# EAGLE design main (EAGLE 9.2.2)

## Sheet 1 of 4: TIVA + IC
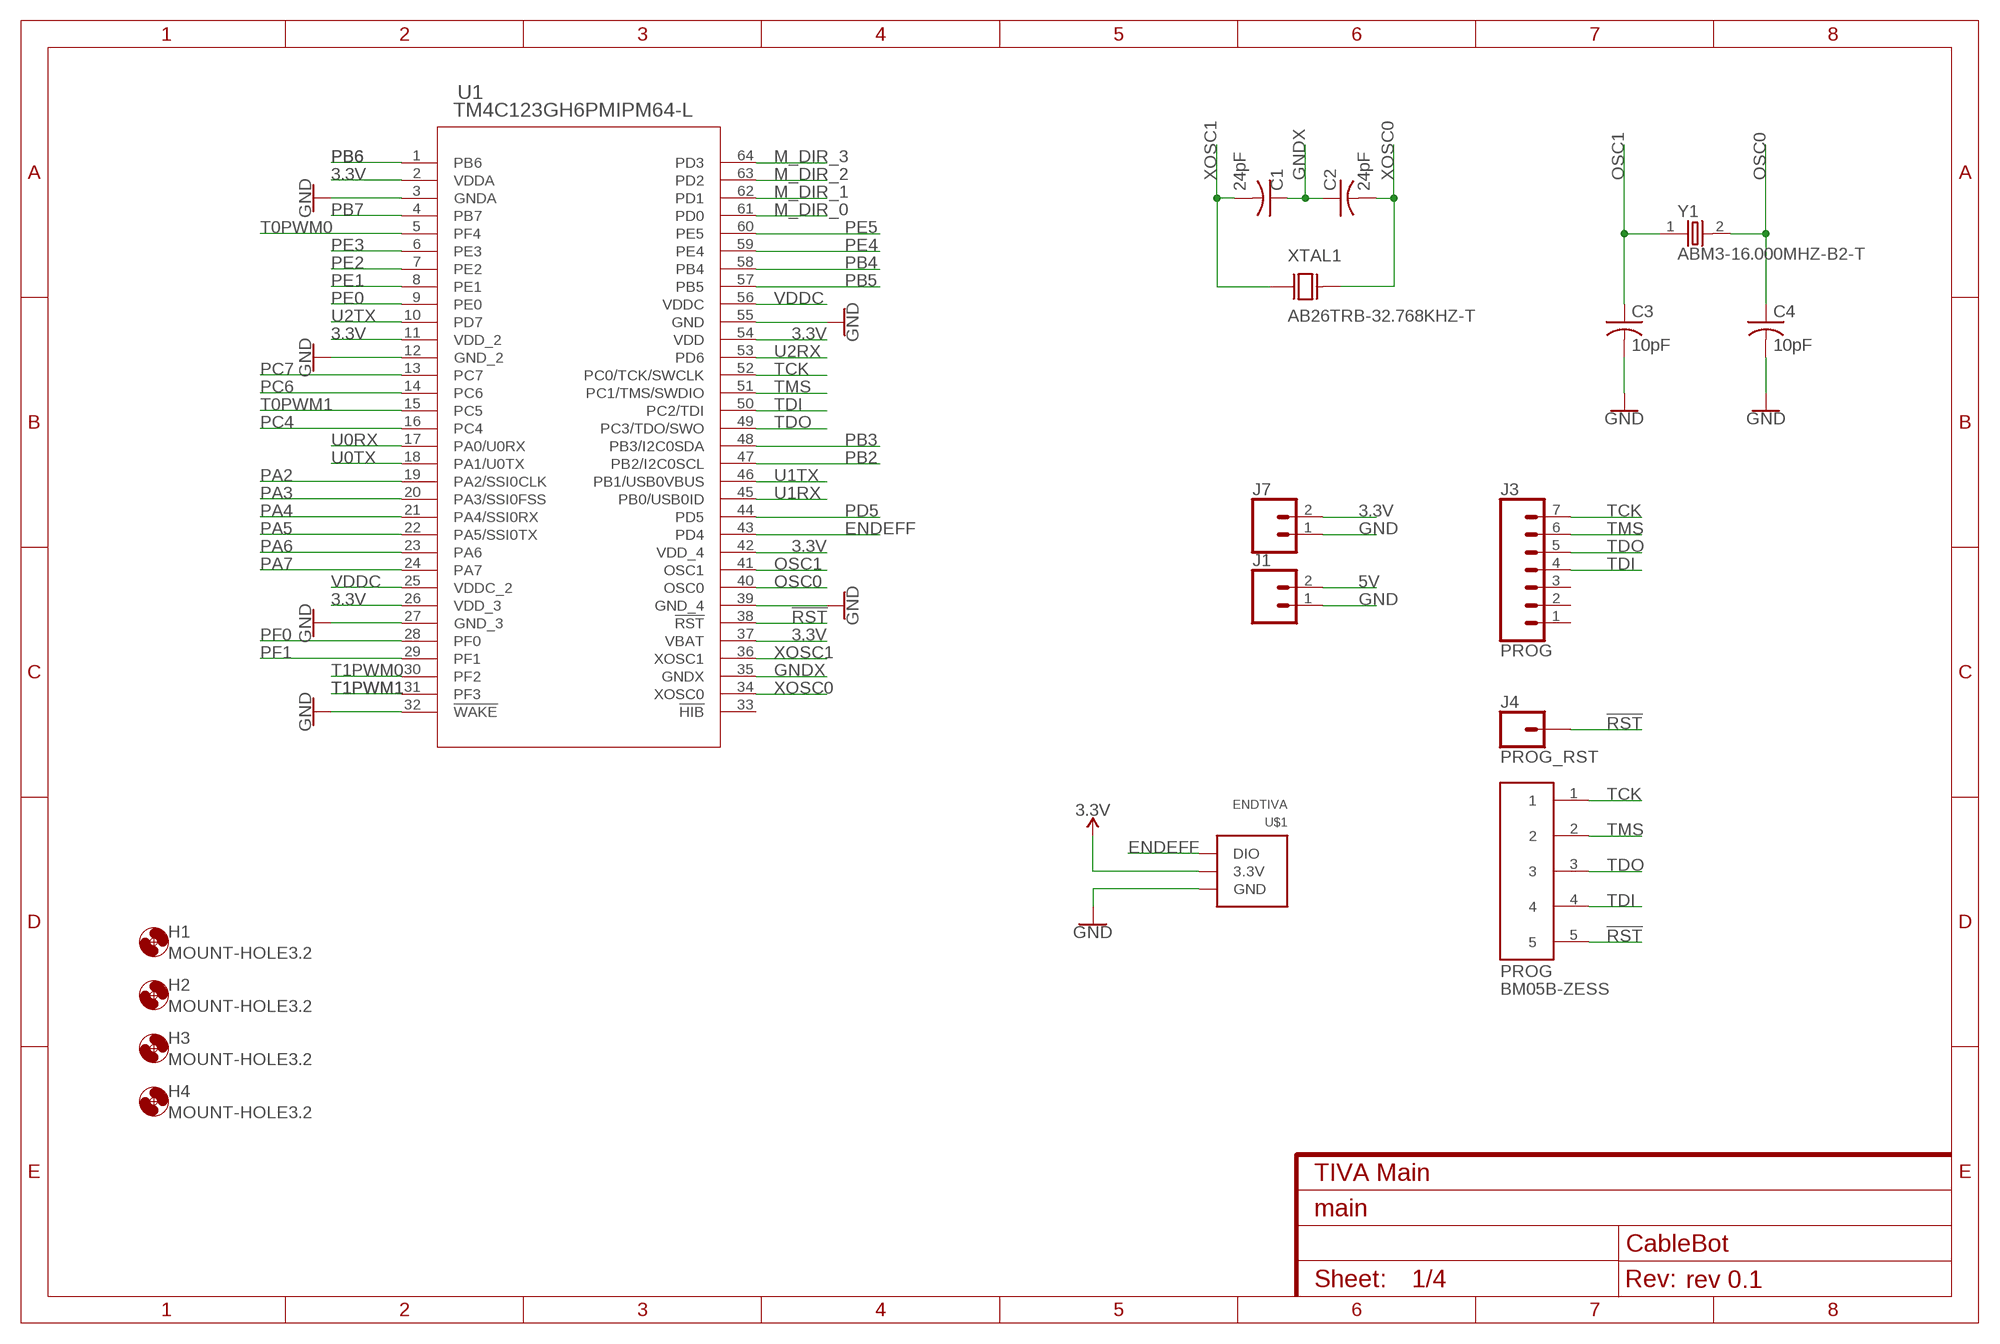
[diagram p0: schematic, sheet 1]
FRAME1 (FRAME-A4L): CNAME: TIVA Main; CREVISION: rev 0.1; DESIGNER: CableBot

### Parts
C1  24pF  C-USC0805  [C0805]
C2  24pF  C-USC0805  [C0805]
C3  10pF  C-USC0805  [C0805]
C4  10pF  C-USC0805  [C0805]
H1  MOUNT-HOLE3.2  [3,2]
H2  MOUNT-HOLE3.2  [3,2]
H3  MOUNT-HOLE3.2  [3,2]
H4  MOUNT-HOLE3.2  [3,2]
J1  CONN_02  [1X02]
J3  PROG  CONN_07  [1X07]
J4  PROG_RST  CONN_01  [1X01]
J7  CONN_02  [1X02]
PROG  BM05B-ZESS  [BM05B-ZESS]
U1  TM4C123GH6PMIPM64-L  [PM64-L]
U$1  ENDTIVA  [ENDTIVA]
XTAL1  AB26TRB-32.768KHZ-T  [XTAL_AB26TRB-32.768KHZ-T]
Y1  ABM3-16.000MHZ-B2-T  [XTAL500X320X130N]

### Nets
3.3V: J7.2 U1.2(VDDA) U1.11(VDD_2) U1.26(VDD_3) U1.37(VBAT) U1.42(VDD_4) U1.54(VDD) U$1.3.3V ; also sheet 2,3,4
5V: J1.2 ; also sheet 2,3,4
!RST: J4.1 PROG.5 U1.38(!RST) ; also sheet 2
ENDEFF: U1.43(PD4) U$1.DIO
GND: C3.2 C4.2 J1.1 J7.1 U1.3(GNDA) U1.12(GND_2) U1.27(GND_3) U1.32(!WAKE) U1.39(GND_4) U1.55(GND) U$1.GND ; also sheet 2,3
GNDX: C1.1 C2.1 U1.35(GNDX)
M_DIR_0: U1.61(PD0) ; also sheet 4
M_DIR_1: U1.62(PD1) ; also sheet 4
M_DIR_2: U1.63(PD2) ; also sheet 4
M_DIR_3: U1.64(PD3) ; also sheet 4
OSC0: C4.1 U1.40(OSC0) Y1.2
OSC1: C3.1 U1.41(OSC1) Y1.1
PA2: U1.19(PA2/SSI0CLK)
PA3: U1.20(PA3/SSI0FSS)
PA4: U1.21(PA4/SSI0RX)
PA5: U1.22(PA5/SSI0TX)
PA6: U1.23(PA6)
PA7: U1.24(PA7)
PB2: U1.47(PB2/I2C0SCL)
PB3: U1.48(PB3/I2C0SDA)
PB4: U1.58(PB4)
PB5: U1.57(PB5)
PB6: U1.1(PB6)
PB7: U1.4(PB7)
PC4: U1.16(PC4)
PC6: U1.14(PC6)
PC7: U1.13(PC7)
PD5: U1.44(PD5)
PE0: U1.9(PE0)
PE1: U1.8(PE1)
PE2: U1.7(PE2)
PE3: U1.6(PE3)
PE4: U1.59(PE4)
PE5: U1.60(PE5)
PF0: U1.28(PF0)
PF1: U1.29(PF1)
T0PWM0: U1.5(PF4) ; also sheet 4
T0PWM1: U1.15(PC5) ; also sheet 4
T1PWM0: U1.30(PF2) ; also sheet 4
T1PWM1: U1.31(PF3) ; also sheet 4
TCK: J3.7 PROG.1 U1.52(PC0/TCK/SWCLK)
TDI: J3.4 PROG.4 U1.50(PC2/TDI)
TDO: J3.5 PROG.3 U1.49(PC3/TDO/SWO)
TMS: J3.6 PROG.2 U1.51(PC1/TMS/SWDIO)
U0RX: U1.17(PA0/U0RX) ; also sheet 3
U0TX: U1.18(PA1/U0TX) ; also sheet 3
U1RX: U1.45(PB0/USB0ID) ; also sheet 3
U1TX: U1.46(PB1/USB0VBUS) ; also sheet 3
U2RX: U1.53(PD6)
U2TX: U1.10(PD7)
VDDC: U1.25(VDDC_2) U1.56(VDDC) ; also sheet 2
XOSC0: C2.2 U1.34(XOSC0) XTAL1.2
XOSC1: C1.2 U1.36(XOSC1) XTAL1.1
Unconnected: J3.1 J3.2 J3.3 U1.33(!HIB)

## Sheet 2 of 4: POWER
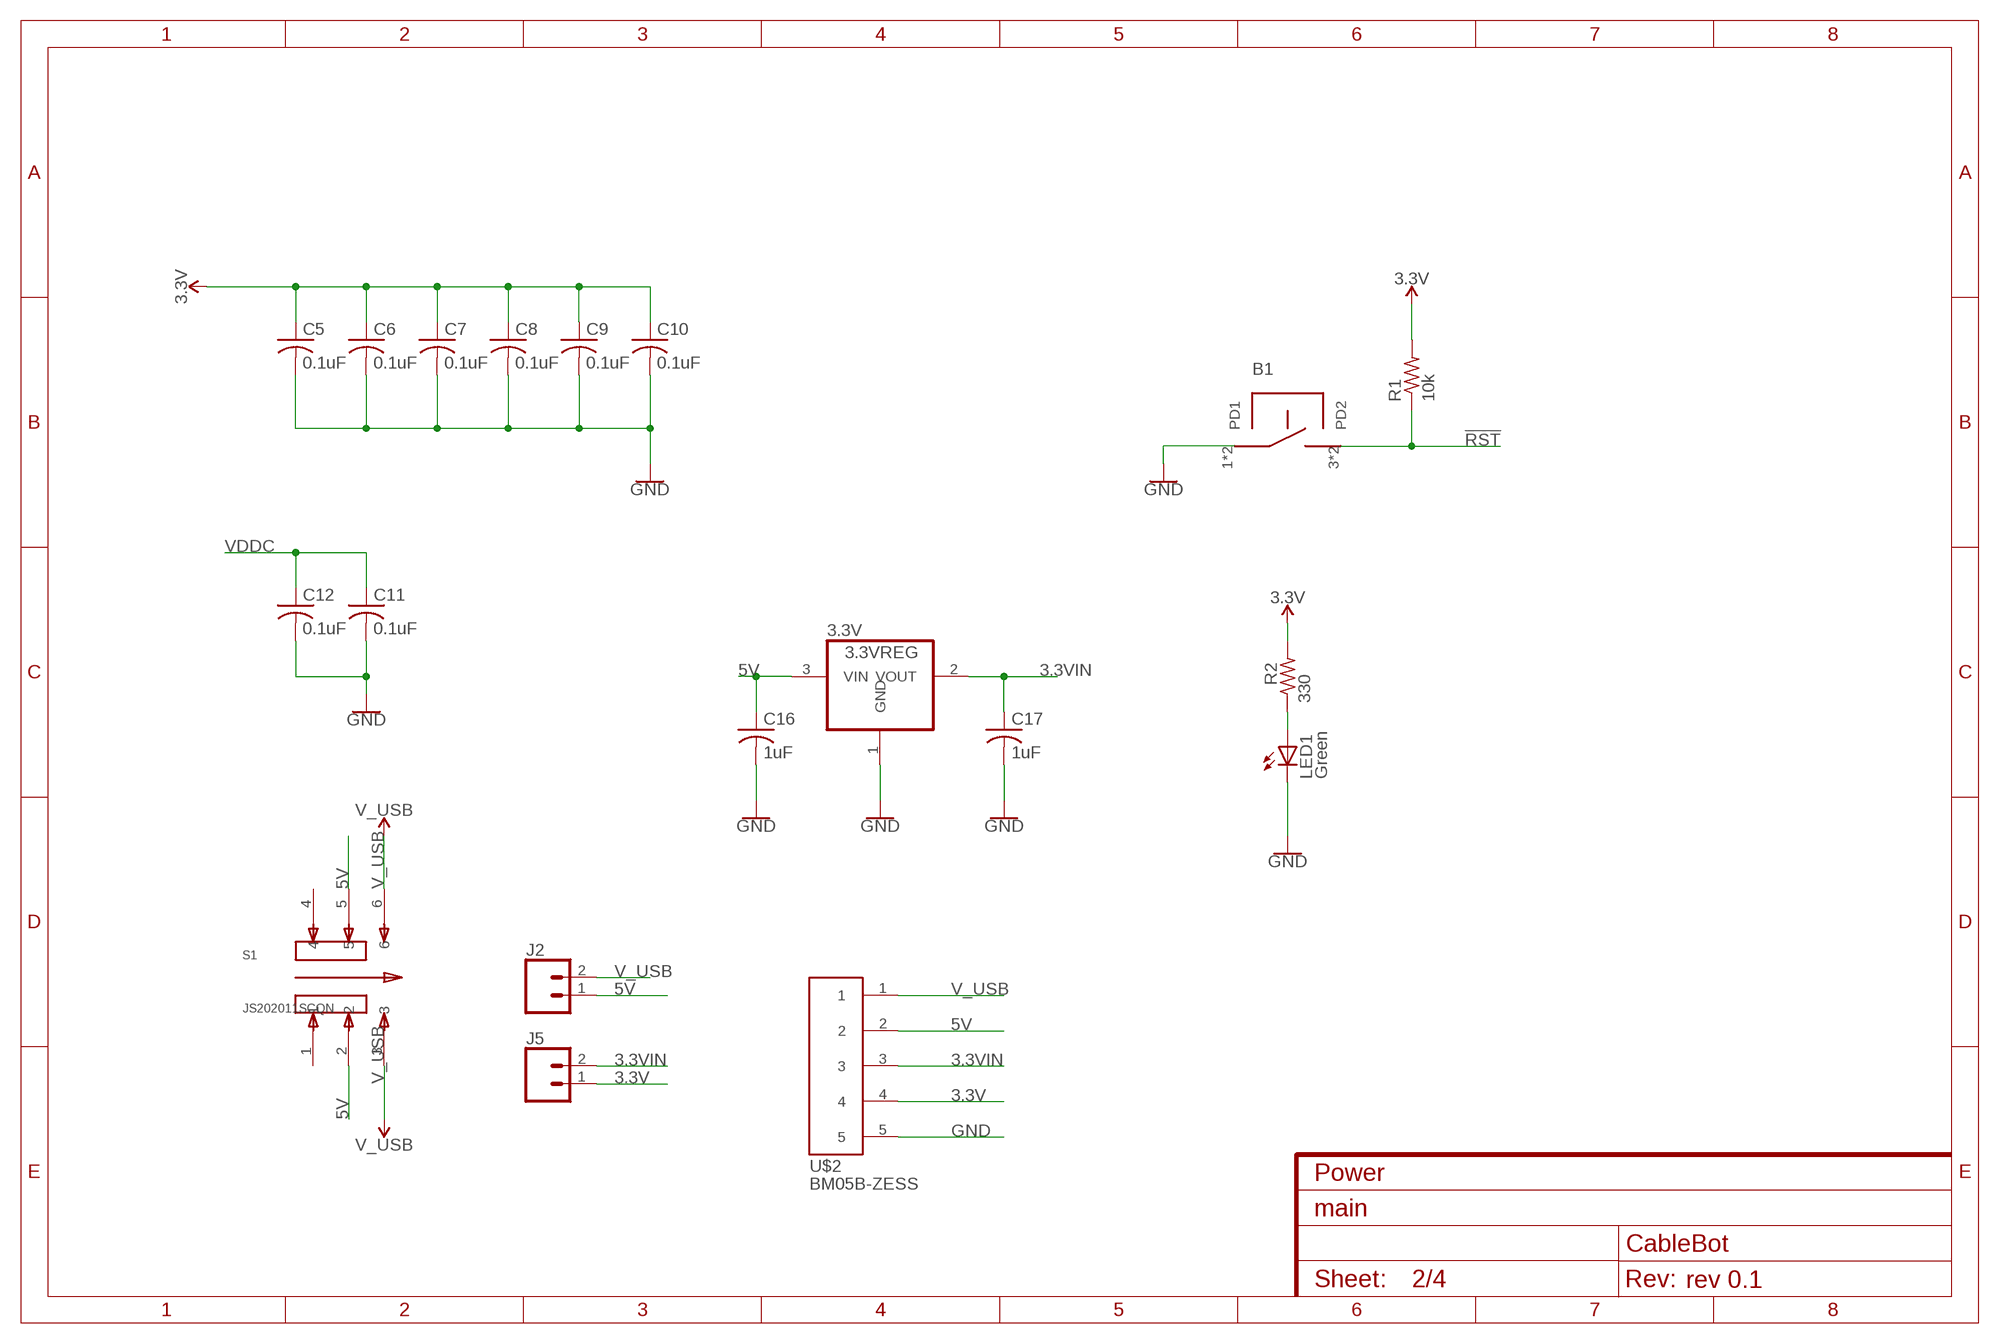
[diagram p1: schematic, sheet 2]
FRAME2 (FRAME-A4L): CNAME: Power; CREVISION: rev 0.1; DESIGNER: CableBot

### Parts
3.3V  3.3VREG  REG1117  [SOT223]
B1  B3S-1000  [SWITCH]
C5  0.1uF  C-USC0805  [C0805]
C6  0.1uF  C-USC0805  [C0805]
C7  0.1uF  C-USC0805  [C0805]
C8  0.1uF  C-USC0805  [C0805]
C9  0.1uF  C-USC0805  [C0805]
C10  0.1uF  C-USC0805  [C0805]
C11  0.1uF  C-USC0805  [C0805]
C12  0.1uF  C-USC0805  [C0805]
C16  1uF  C-USC0805  [C0805]
C17  1uF  C-USC0805  [C0805]
J2  CONN_02  [1X02]
J5  CONN_02  [1X02]
LED1  Green  LEDCHIP-LED0805  [CHIP-LED0805]
R1  10k  R-US_R0603  [R0603]
R2  330  R-US_R0805  [R0805]
S1  JS202011SCQN  [SW_JS202011SCQN]
U$2  BM05B-ZESS  [BM05B-ZESS]

### Nets
3.3V: C5.1 C6.1 C7.1 C8.1 C9.1 C10.1 J5.1 R1.2 R2.2 U$2.4 ; also sheet 1,3,4
3.3VIN: 3.3V.2(VOUT) C17.1 J5.2 U$2.3 ; also sheet 3
5V: 3.3V.3(VIN) C16.1 J2.1 S1.2 S1.5 U$2.2 ; also sheet 1,3,4
!RST: B1.3(PD2) B1.4(PD2) R1.1 ; also sheet 1
GND: 3.3V.1(GND) B1.1(PD1) B1.2(PD1) C5.2 C6.2 C7.2 C8.2 C9.2 C10.2 C11.2 C12.2 C16.2 C17.2 LED1.C U$2.5 ; also sheet 1,3
N$1: LED1.A R2.1
V_USB: J2.2 S1.3 S1.6 U$2.1 ; also sheet 3
VDDC: C11.1 C12.1 ; also sheet 1
Unconnected: S1.1 S1.4

## Sheet 3 of 4: COMMUNICATION
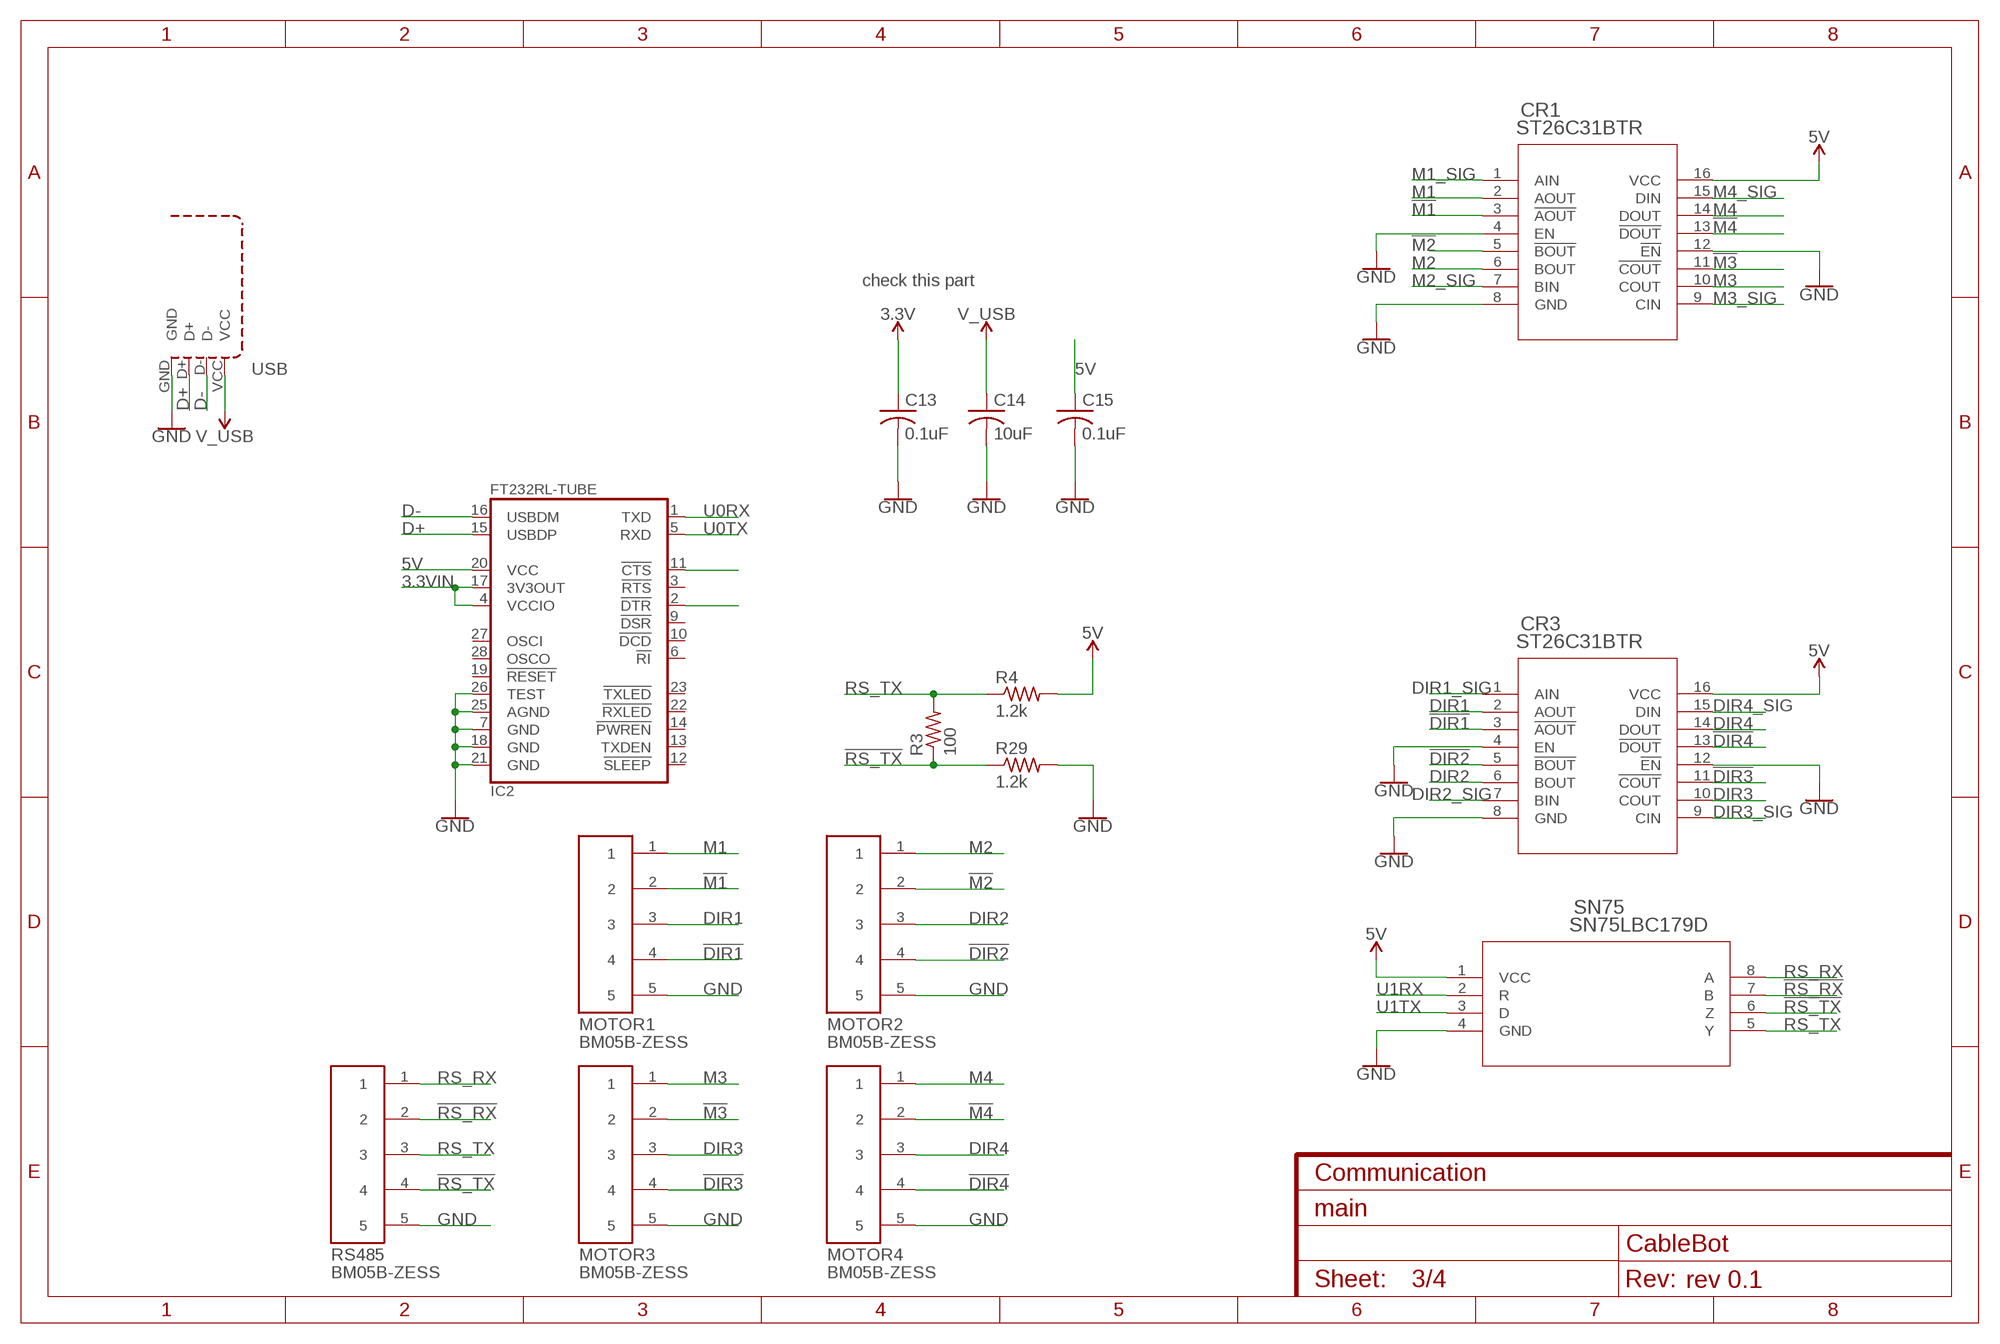
[diagram p2: schematic, sheet 3]
FRAME3 (FRAME-A4L): CNAME: Communication; CREVISION: rev 0.1; DESIGNER: CableBot

### Parts
C13  0.1uF  C-USC0805  [C0805]
C14  10uF  C-USC0805  [C0805]
C15  0.1uF  C-USC0805  [C0805]
CR1  ST26C31BTR  [TSSOP16]
CR3  ST26C31BTR  [TSSOP16]
IC2  FT232RL-TUBE  [SSOP28-LD]
MOTOR1  BM05B-ZESS  [BM05B-ZESS]
MOTOR2  BM05B-ZESS  [BM05B-ZESS]
MOTOR3  BM05B-ZESS  [BM05B-ZESS]
MOTOR4  BM05B-ZESS  [BM05B-ZESS]
R3  100  R-US_R0805  [R0805]
R4  1.2k  R-US_R0805  [R0805]
R29  1.2k  R-US_R0805  [R0805]
RS485  BM05B-ZESS  [BM05B-ZESS]
SN75  SN75LBC179D  [D8]
USB  ZX62MICROUSB  [ZX62-AB-5PA(11)]

### Nets
3.3V: C13.1 ; also sheet 1,2,4
3.3VIN: IC2.4(VCCIO) IC2.17(3V3OUT) ; also sheet 2
5V: C15.1 CR1.16(VCC) CR3.16(VCC) IC2.20(VCC) R4.2 SN75.1(VCC) ; also sheet 1,2,4
!DIR1: CR3.3(!AOUT) MOTOR1.4
!DIR2: CR3.5(!BOUT) MOTOR2.4
!DIR3: CR3.11(!COUT) MOTOR3.4
!DIR4: CR3.13(!DOUT) MOTOR4.4
!M1: CR1.3(!AOUT) MOTOR1.2
!M2: CR1.5(!BOUT) MOTOR2.2
!M3: CR1.11(!COUT) MOTOR3.2
!M4: CR1.13(!DOUT) MOTOR4.2
!RS_RX: RS485.2 SN75.7(B)
!RS_TX: R3.1 R29.1 RS485.4 SN75.6(Z)
D+: IC2.15(USBDP) USB.D+
D-: IC2.16(USBDM) USB.D-
DIR1: CR3.2(AOUT) MOTOR1.3
DIR1_SIG: CR3.1(AIN) ; also sheet 4
DIR2: CR3.6(BOUT) MOTOR2.3
DIR2_SIG: CR3.7(BIN) ; also sheet 4
DIR3: CR3.10(COUT) MOTOR3.3
DIR3_SIG: CR3.9(CIN) ; also sheet 4
DIR4: CR3.14(DOUT) MOTOR4.3
DIR4_SIG: CR3.15(DIN) ; also sheet 4
GND: C13.2 C14.2 C15.2 CR1.4(EN) CR1.8(GND) CR1.12(!EN) CR3.4(EN) CR3.8(GND) CR3.12(!EN) IC2.7(GND) IC2.18(GND) IC2.21(GND) IC2.25(AGND) IC2.26(TEST) MOTOR1.5 MOTOR2.5 MOTOR3.5 MOTOR4.5 R29.2 RS485.5 SN75.4(GND) USB.GND ; also sheet 1,2
M1: CR1.2(AOUT) MOTOR1.1
M1_SIG: CR1.1(AIN) ; also sheet 4
M2: CR1.6(BOUT) MOTOR2.1
M2_SIG: CR1.7(BIN) ; also sheet 4
M3: CR1.10(COUT) MOTOR3.1
M3_SIG: CR1.9(CIN) ; also sheet 4
M4: CR1.14(DOUT) MOTOR4.1
M4_SIG: CR1.15(DIN) ; also sheet 4
N$7: IC2.2(!DTR)
N$8: IC2.11(!CTS)
RS_RX: RS485.1 SN75.8(A)
RS_TX: R3.2 R4.1 RS485.3 SN75.5(Y)
U0RX: IC2.1(TXD) ; also sheet 1
U0TX: IC2.5(RXD) ; also sheet 1
U1RX: SN75.2(R) ; also sheet 1
U1TX: SN75.3(D) ; also sheet 1
V_USB: C14.1 USB.VCC ; also sheet 2
Unconnected: IC2.3(!RTS) IC2.6(!RI) IC2.9(!DSR) IC2.10(!DCD) IC2.12(!SLEEP) IC2.13(TXDEN) IC2.14(!PWREN) IC2.19(!RESET) IC2.22(!RXLED) IC2.23(!TXLED) IC2.27(OSCI) IC2.28(OSCO)

### Notes on the sheet
- check this part

## Sheet 4 of 4
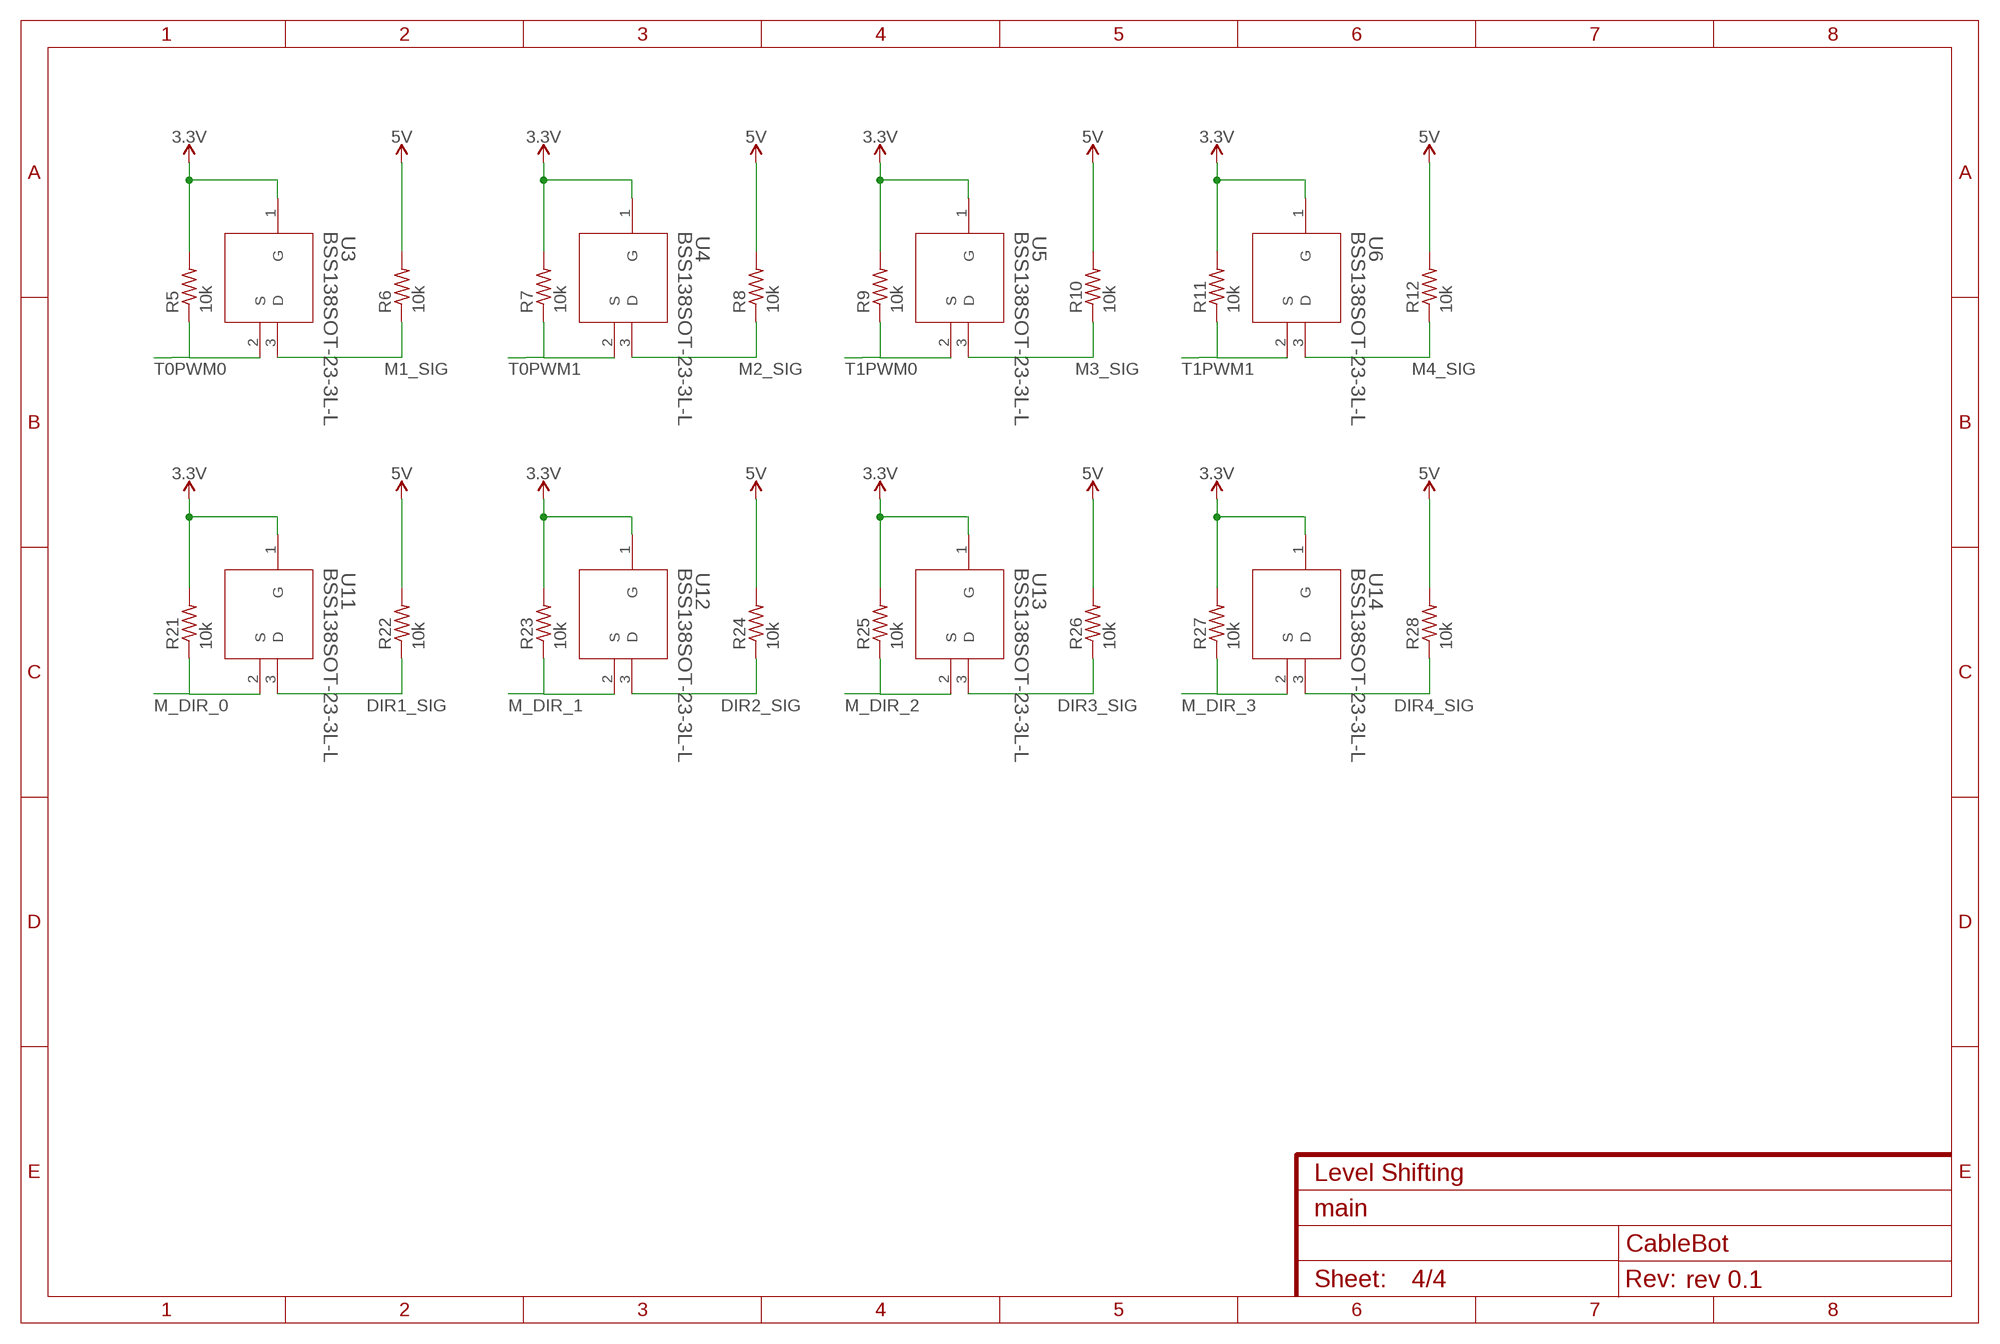
[diagram p3: schematic, sheet 4]
FRAME4 (FRAME-A4L): CNAME: Level Shifting; CREVISION: rev 0.1; DESIGNER: CableBot

### Parts
R5  10k  R-US_R0603  [R0603]
R6  10k  R-US_R0603  [R0603]
R7  10k  R-US_R0603  [R0603]
R8  10k  R-US_R0603  [R0603]
R9  10k  R-US_R0603  [R0603]
R10  10k  R-US_R0603  [R0603]
R11  10k  R-US_R0603  [R0603]
R12  10k  R-US_R0603  [R0603]
R21  10k  R-US_R0603  [R0603]
R22  10k  R-US_R0603  [R0603]
R23  10k  R-US_R0603  [R0603]
R24  10k  R-US_R0603  [R0603]
R25  10k  R-US_R0603  [R0603]
R26  10k  R-US_R0603  [R0603]
R27  10k  R-US_R0603  [R0603]
R28  10k  R-US_R0603  [R0603]
U3  BSS138SOT-23-3L-L  [SOT-23-3L-L]
U4  BSS138SOT-23-3L-L  [SOT-23-3L-L]
U5  BSS138SOT-23-3L-L  [SOT-23-3L-L]
U6  BSS138SOT-23-3L-L  [SOT-23-3L-L]
U11  BSS138SOT-23-3L-L  [SOT-23-3L-L]
U12  BSS138SOT-23-3L-L  [SOT-23-3L-L]
U13  BSS138SOT-23-3L-L  [SOT-23-3L-L]
U14  BSS138SOT-23-3L-L  [SOT-23-3L-L]

### Nets
3.3V: R5.2 R7.2 R9.2 R11.2 R21.2 R23.2 R25.2 R27.2 U3.1(G) U4.1(G) U5.1(G) U6.1(G) U11.1(G) U12.1(G) U13.1(G) U14.1(G) ; also sheet 1,2,3
5V: R6.2 R8.2 R10.2 R12.2 R22.2 R24.2 R26.2 R28.2 ; also sheet 1,2,3
DIR1_SIG: R22.1 U11.3(D) ; also sheet 3
DIR2_SIG: R24.1 U12.3(D) ; also sheet 3
DIR3_SIG: R26.1 U13.3(D) ; also sheet 3
DIR4_SIG: R28.1 U14.3(D) ; also sheet 3
M1_SIG: R6.1 U3.3(D) ; also sheet 3
M2_SIG: R8.1 U4.3(D) ; also sheet 3
M3_SIG: R10.1 U5.3(D) ; also sheet 3
M4_SIG: R12.1 U6.3(D) ; also sheet 3
M_DIR_0: R21.1 U11.2(S) ; also sheet 1
M_DIR_1: R23.1 U12.2(S) ; also sheet 1
M_DIR_2: R25.1 U13.2(S) ; also sheet 1
M_DIR_3: R27.1 U14.2(S) ; also sheet 1
T0PWM0: R5.1 U3.2(S) ; also sheet 1
T0PWM1: R7.1 U4.2(S) ; also sheet 1
T1PWM0: R9.1 U5.2(S) ; also sheet 1
T1PWM1: R11.1 U6.2(S) ; also sheet 1

## Library data of the parts
3.3V = burr-brown:REG1117: 800mA and 1A Low Dropout (LDO) Positive Regulator 1.8V, 2.5V, 2.85V, 3.3V, 5V, and Adj; MPN: REG1117; OC_FARNELL: 1097566; OC_NEWARK: 14P6981
B1 = tiva:B3S-1000: Momentary Switch; MANUFACTURER_PART_NUMBER: B3S-1000; VENDOR: Omron
C1-C17 = adafruit:C-US: CAPACITOR, American symbol
CR1 CR3 = tiva:ST26C31BTR; MANUFACTURER_PART_NUMBER: ST26C31BTR; VENDOR: STMicroelectronics
H1-H4 = holes:MOUNT-HOLE: MOUNTING HOLE with drill center marker
IC2 = FT232RL-TUBE:FT232RL-TUBE; DESCRIPTION: USB-to-UART 1-CH 256byte FIFO 5V 28-Pin SSOP Tube; DIGI-KEY_PART_NUMBER: 768-1306-ND; DIGI-KEY_PURCHASE_URL: https://www.digikey.com/product-detail/en/ftdi-future-technology-devices-international-ltd/FT232RL-TUBE/768-1306-ND/4006920?utm_source=snapeda&utm_medium=aggregator&utm_campaign=symbol; MF: FTDI,; MP: FT232RL-TUBE; PACKAGE: SSOP-28 FTDI
J1 J2 J5 J7 = SparkFun-Connectors:CONN_02: Multi connection point. Often used as Generic Header-pin footprint for 0.1 inch spaced/style header connections On any of the 0.1 inch spaced packages, you can populate with these: Break Away Headers - Straight <https://www.sparkfun.com/products/116> (PRT-00116) Break Away Male Headers - Right Angle <https://www.sparkfun.com/products/553> (PRT-00553) Female Headers <https://www.sparkfun.com/products/115> (PRT-00115) Break Away Headers - Machine Pin <https://www.sparkfun.com/products/117> (PRT-00117) Break Away Female Headers - Swiss Machine Pin <https://www.sparkfun.com/products/743> (PRT-00743) For SCREWTERMINALS and SPRING TERMINALS visit here: Screw Terimnals on SparkFun.com <https://www.sparkfun.com/search/results?term=Screw+Terminals> (5mm/3.5mm/2.54mm spacing) This device is also useful as a general connection point to wire up your design to another part of your project. Our various solder wires solder well into these plated through hole pads. Hook-Up Wire - Assortment (Stranded, 22 AWG) <https://www.sparkfun.com/products/11375> (PRT-11375) Hook-Up Wire - Assortment (Solid Core, 22 AWG) <https://www.sparkfun.com/products/11367> (PRT-11367) View the entire wire category on our website here <https://www.sparkfun.com/categories/141> Special notes: Molex polarized connector foot print use with: PRT-08233 with associated crimp pins and housings. 2.54_SCREWTERM for use with PRT-10571. 3.5mm Screw Terminal footprints for PRT-08084 5mm Screw Terminal footprints for use with PRT-08432
J3 = SparkFun-Connectors:CONN_07: Multi connection point. Often used as Generic Header-pin footprint for 0.1 inch spaced/style header connections On any of the 0.1 inch spaced packages, you can populate with these: Break Away Headers - Straight <https://www.sparkfun.com/products/116> (PRT-00116) Break Away Male Headers - Right Angle <https://www.sparkfun.com/products/553> (PRT-00553) Female Headers <https://www.sparkfun.com/products/115> (PRT-00115) Break Away Headers - Machine Pin <https://www.sparkfun.com/products/117> (PRT-00117) Break Away Female Headers - Swiss Machine Pin <https://www.sparkfun.com/products/743> (PRT-00743) For SCREWTERMINALS and SPRING TERMINALS visit here: Screw Terimnals on SparkFun.com <https://www.sparkfun.com/search/results?term=Screw+Terminals> (5mm/3.5mm/2.54mm spacing) This device is also useful as a general connection point to wire up your design to another part of your project. Our various solder wires solder well into these plated through hole pads. Hook-Up Wire - Assortment (Stranded, 22 AWG) <https://www.sparkfun.com/products/11375> (PRT-11375) Hook-Up Wire - Assortment (Solid Core, 22 AWG) <https://www.sparkfun.com/products/11367> (PRT-11367) View the entire wire category on our website here <https://www.sparkfun.com/categories/141> Special notes: Molex polarized connector foot print use with SKU : PRT-08231 with associated crimp pins and housings. 1MM SMD Version SKU: PRT-10208 NOTES ON THE VARIANTS LOCK and LOCK_LONGPADS... This footprint was designed to help hold the alignment of a through-hole component (i.e. 6-pin header) while soldering it into place. You may notice that each hole has been shifted either up or down by 0.005 of an inch from it's more standard position (which is a perfectly straight line). This slight alteration caused the pins (the squares in the middle) to touch the edges of the holes. Because they are alternating, it causes a "brace" to hold the component in place. 0.005 has proven to be the perfect amount of "off-center" position when using our standard breakaway headers. Although looks a little odd when you look at the bare footprint, once you have a header in there, the alteration is very hard to notice. Also,if you push a header all the way into place, it is covered up entirely on the bottom side.
J4 = SparkFun-Connectors:CONN_01: Single connection point. Often used as Generic Header-pin footprint for 0.1 inch spaced/style header connections On any of the 0.1 inch spaced packages, you can populate with these: Break Away Headers - Straight <https://www.sparkfun.com/products/116> (PRT-00116) Break Away Male Headers - Right Angle <https://www.sparkfun.com/products/553> (PRT-00553) Female Headers <https://www.sparkfun.com/products/115> (PRT-00115) Break Away Headers - Machine Pin <https://www.sparkfun.com/products/117> (PRT-00117) Break Away Female Headers - Swiss Machine Pin <https://www.sparkfun.com/products/743> (PRT-00743) This device is also useful as a general connection point to wire up your design to another part of your project. Our various solder wires solder well into these plated through hole pads. Hook-Up Wire - Assortment (Stranded, 22 AWG) <https://www.sparkfun.com/products/11375> (PRT-11375) Hook-Up Wire - Assortment (Solid Core, 22 AWG) <https://www.sparkfun.com/products/11367> (PRT-11367) View the entire wire category on our website here <https://www.sparkfun.com/categories/141> Special notes: SMTSO-256-ET is a "flush mount" nut for a 4-40 screw. We mostly use this on specialty testbeds; it is a nice way to connect hardware to your PCB at an adjustable hieght. Also note, the SNAP packages are for using a snappable style connector. We sell a baggie of snaps and they are also used on two LilyPad designs: Snap Assortment - 30 pack (male and female) <https://www.sparkfun.com/products/11347> (DEV-11347) LilyPad Arduino SimpleSnap <https://www.sparkfun.com/products/10941> (DEV-10941) LilyPad SimpleSnap Protoboard <https://www.sparkfun.com/products/10940> (DEV-10940)
LED1 = adafruit:LED: LED OSRAM: - CHIPLED LG R971, LG N971, LY N971, LG Q971, LY Q971, LO R971, LY R971 LH N974, LH R974 LS Q976, LO Q976, LY Q976 LO Q996 - Hyper CHIPLED LW Q18S LB Q993, LB Q99A, LB R99A - SideLED LS A670, LO A670, LY A670, LG A670, LP A670 LB A673, LV A673, LT A673, LW A673 LH A674 LY A675 LS A676, LA A676, LO A676, LY A676, LW A676 LS A679, LY A679, LG A679 - Hyper Micro SIDELED® LS Y876, LA Y876, LO Y876, LY Y876 LT Y87S - SmartLED LW L88C, LW L88S LB L89C, LB L89S, LG L890 LS L89K, LO L89K, LY L89K LS L896, LA L896, LO L896, LY L896 - TOPLED LS T670, LO T670, LY T670, LG T670, LP T670 LSG T670, LSP T670, LSY T670, LOP T670, LYG T670 LG T671, LOG T671, LSG T671 LB T673, LV T673, LT T673, LW T673 LH T674 LS T676, LA T676, LO T676, LY T676, LB T676, LH T676, LSB T676, LW T676 LB T67C, LV T67C, LT T67C, LS T67K, LO T67K, LY T67K, LW E67C LS E67B, LA E67B, LO E67B, LY E67B, LB E67C, LV E67C, LT E67C LW T67C LS T679, LY T679, LG T679 LS T770, LO T770, LY T770, LG T770, LP T770 LB T773, LV T773, LT T773, LW T773 LH T774 LS E675, LA E675, LY E675, LS T675 LS T776, LA T776, LO T776, LY T776, LB T776 LHGB T686 LT T68C, LB T68C - Hyper Mini TOPLED® LB M676 - Mini TOPLED Santana® LG M470 LS M47K, LO M47K, LY M47K Source: http://www.osram.convergy.de/
MOTOR1-MOTOR4 PROG RS485 U$2 = tiva:BM05B-ZESS
R1 R2 R5-R12 R21-R28 = adafruit:R-US_: RESISTOR, American symbol
R3 R4 R29 = resistor:R-US_: RESISTOR, American symbol
S1 = JS202011SCQN:JS202011SCQN: JS Series DPDT On-On Gull Wing Surface Mount Subminiature Slide Switch; AVAILABILITY: Unavailable; DESCRIPTION: JS Series DPDT On-On Gull Wing Surface Mount Subminiature Slide Switch; MF: C&K; MP: JS202011SCQN; PACKAGE: None; PRICE: None
SN75 = tiva:SN75LBC179D; MANUFACTURER_PART_NUMBER: SN75LBC179D; VENDOR: Texas Instruments
U1 = tiva:TM4C123GH6PMI; MANUFACTURER_PART_NUMBER: TM4C123GH6PMI; VENDOR: Texas Instruments
U3-U6 U11-U14 = tiva:BSS138: MOSFET; MANUFACTURER_PART_NUMBER: BSS138; VENDOR: Fairchild Semiconductor
U$1 = tiva:ENDTIVA
USB = ZX62-AB-5PA_11_:ZX62MICROUSB
XTAL1 = AB26TRB-32.768KHZ-T:AB26TRB-32.768KHZ-T: AB26TRB Series 32.768 kHz ±20 ppm 12.5 pF -40 to +85°C Cylindrical Watch Crystal; DESCRIPTION: AB26TRB Series 32.768 kHz ±20 ppm 12.5 pF -40 to +85°C Cylindrical Watch Crystal; DIGI-KEY_PART_NUMBER: 535-9033-1-ND; DIGI-KEY_PURCHASE_URL: https://www.digikey.com/product-detail/en/abracon-llc/AB26TRB-32.768KHZ-T/535-9033-1-ND/675581?utm_source=snapeda&utm_medium=aggregator&utm_campaign=symbol; MF: Abracon; MP: AB26TRB-32.768KHZ-T; PACKAGE: Cylindrical Can Radial Abracon
Y1 = ABM3-16.000MHZ-B2-T:ABM3-16.000MHZ-B2-T: Crystals 12MHz 18pF 30ppm -40C +85C; DESCRIPTION: Crystal 16MHz Ø·Â¢Ø¢Â±20ppm _Tol_ Ø·Â¢Ø¢Â±50ppm _Stability_ 18pF FUND 50Ohm 2-Pin CSMD T/R; DIGI-KEY_PART_NUMBER: 535-9103-1-ND; DIGI-KEY_PURCHASE_URL: https://www.digikey.com/product-detail/en/abracon-llc/ABM3-16.000MHZ-B2-T/535-9103-1-ND/675620?utm_source=snapeda&utm_medium=aggregator&utm_campaign=symbol; MF: Abracon; MP: ABM3-16.000MHZ-B2-T; PACKAGE: SMD-2 Abracon

## Board
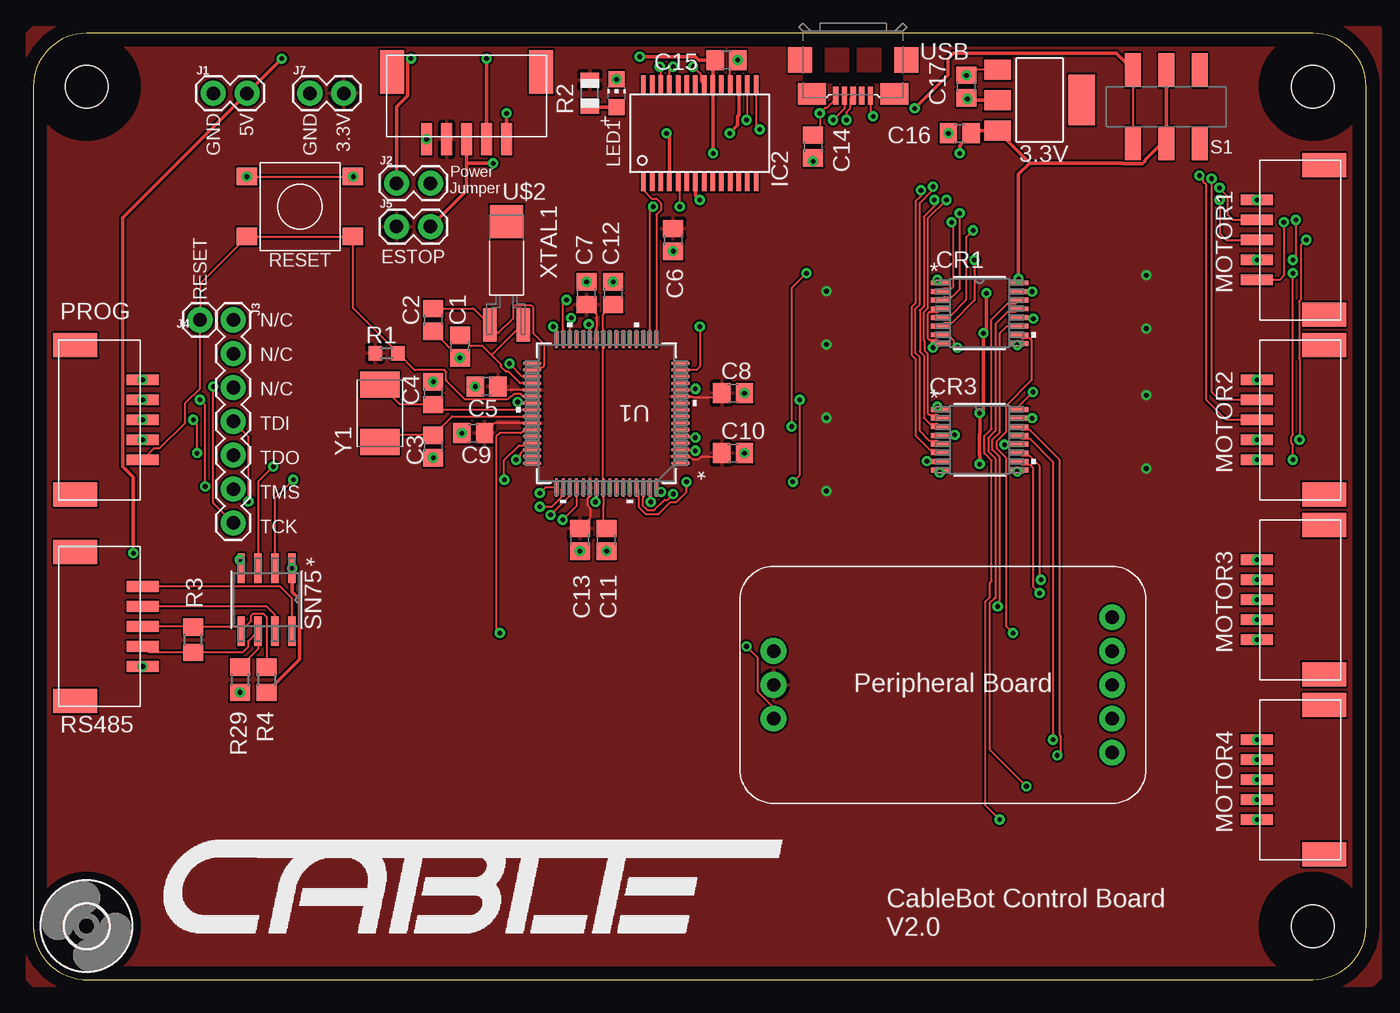
[diagram p4: board, top side]
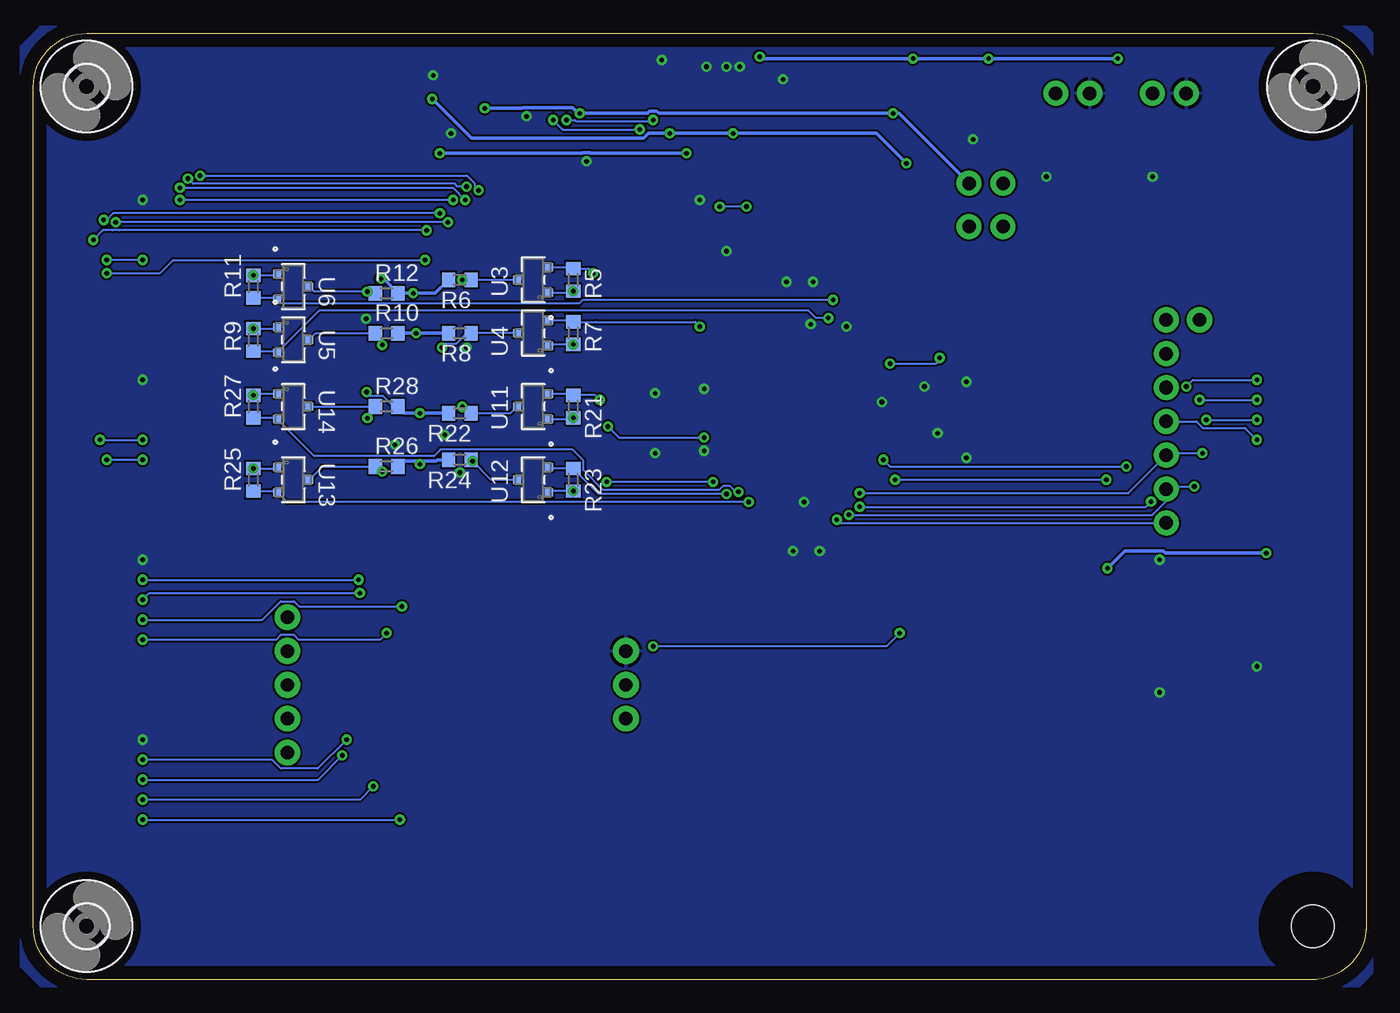
[diagram p5: board, bottom side, seen from below]

Size 100 x 71 mm. Coordinates in mm from the lower left corner, seen from the top.
Outline: 0,4 0,3.75
Outline: 3.75,0 4,0
Outline: 0,4 0,67 arc-90 4,71 96,71 arc-90 100,67 100,4 arc-90 96,0 7.25,0 4,0
Outline: 0,4 arc90 4,0
Copper layers (1*16): Top 0.035mm / dielectric 1.5mm / Bottom 0.035mm
Design rules "default *": minimum track width 6mil, minimum drill 0.35mm, track to track 6mil, track to pad 6mil, pad to pad 6mil, via to via 6mil, smd to smd 6mil, copper to edge 40mil, drill to drill 6mil, minimum pad ring 10mil, minimum via ring 8mil, stop-mask expansion 0mil, vias tented up to drill 25mil, thermal gap 10mil

### Footprints (pad centres in the part's own frame; a part is rotated, then mirrored left to right if it is on the bottom)
SOT223 = smd 1.499 x 2.007: 1 -2.261,-3.15; 2 0.025,-3.15; 3 2.311,-3.15 | smd 3.81 x 2.007: 4 0,3.15
SWITCH = smd 1.55 x 1.3: 1 -3.975,2.25; 2 3.975,2.25; 3 3.975,-2.25; 4 -3.975,-2.25
C0805 = smd 1.3 x 1.5: 1 -0.85,0; 2 0.85,0
TSSOP16 = smd 1.473 x 0.356: 1 -2.921,2.275; 2 -2.921,1.625; 3 -2.921,0.975; 4 -2.921,0.325; 5 -2.921,-0.325; 6 -2.921,-0.975; 7 -2.921,-1.625; 8 -2.921,-2.275; 9 2.921,-2.275; 10 2.921,-1.625; 11 2.921,-0.975; 12 2.921,-0.325; 13 2.921,0.325; 14 2.921,0.975; 15 2.921,1.625; 16 2.921,2.275
3,2 = hole 3.2: 0,0
SSOP28-LD = smd 0.348 x 1.397: 1 -4.225,-3.656; 2 -3.575,-3.656; 3 -2.925,-3.656; 4 -2.275,-3.656; 5 -1.625,-3.656; 6 -0.975,-3.656; 7 -0.325,-3.656; 8 0.325,-3.656; 9 0.975,-3.656; 10 1.625,-3.656; 11 2.275,-3.656; 12 2.925,-3.656; 13 3.575,-3.656; 14 4.225,-3.656; 15 4.225,3.656; 16 3.575,3.656; 17 2.925,3.656; 18 2.275,3.656; 19 1.625,3.656; 20 0.975,3.656; 21 0.325,3.656; 22 -0.325,3.656; 23 -0.975,3.656; 24 -1.625,3.656; 25 -2.275,3.656; 26 -2.925,3.656; 27 -3.575,3.656; 28 -4.225,3.656
1X02 = drill 1.016 pad 1.88: 1 0,0; 2 2.54,0
1X07 = drill 1.016 pad 1.88: 1 0,0; 2 2.54,0; 3 5.08,0; 4 7.62,0; 5 10.16,0; 6 12.7,0; 7 15.24,0
1X01 = drill 1.016 pad 1.88: 1 0,0
CHIP-LED0805 = smd 1.2 x 1.2: A 0,-1.05; C 0,1.05
BM05B-ZESS = smd 0.8 x 2.4: 1 -3,6.7; 2 -1.5,6.7; 3 0,6.7; 4 1.5,6.7; 5 3,6.7 | smd 1.8 x 3.3: P$1 -5.6,1.65; P$2 5.6,1.65
R0603 = smd 1 x 1.1: 1 -0.85,0; 2 0.85,0
R0805 = smd 1.1 x 1.4: 1 -1,0; 2 1,0
R0805' = smd 1.3 x 1.5: 1 -0.95,0; 2 0.95,0
SW_JS202011SCQN = smd 1.2 x 2.5: 1 -2.5,-2.75; 2 0,-2.75; 3 2.5,-2.75; 4 -2.5,2.75; 5 0,2.75; 6 2.5,2.75
D8 = smd 2.184 x 0.559: 1 -2.362,1.905; 2 -2.362,0.635; 3 -2.362,-0.635; 4 -2.362,-1.905; 5 2.362,-1.905; 6 2.362,-0.635; 7 2.362,0.635; 8 2.362,1.905
PM64-L = smd 1.353 x 0.199: 1 -5.57,3.75; 2 -5.57,3.25; 3 -5.57,2.75; 4 -5.57,2.25; 5 -5.57,1.75; 6 -5.57,1.25; 7 -5.57,0.75; 8 -5.57,0.25; 9 -5.57,-0.25; 10 -5.57,-0.75; 11 -5.57,-1.25; 12 -5.57,-1.75; 13 -5.57,-2.25; 14 -5.57,-2.75; 15 -5.57,-3.25; 16 -5.57,-3.75; 33 5.57,-3.75; 34 5.57,-3.25; 35 5.57,-2.75; 36 5.57,-2.25; 37 5.57,-1.75; 38 5.57,-1.25; 39 5.57,-0.75; 40 5.57,-0.25; 41 5.57,0.25; 42 5.57,0.75; 43 5.57,1.25; 44 5.57,1.75; 45 5.57,2.25; 46 5.57,2.75; 47 5.57,3.25; 48 5.57,3.75 | smd 0.199 x 1.353: 17 -3.75,-5.57; 18 -3.25,-5.57; 19 -2.75,-5.57; 20 -2.25,-5.57; 21 -1.75,-5.57; 22 -1.25,-5.57; 23 -0.75,-5.57; 24 -0.25,-5.57; 25 0.25,-5.57; 26 0.75,-5.57; 27 1.25,-5.57; 28 1.75,-5.57; 29 2.25,-5.57; 30 2.75,-5.57; 31 3.25,-5.57; 32 3.75,-5.57; 49 3.75,5.57; 50 3.25,5.57; 51 2.75,5.57; 52 2.25,5.57; 53 1.75,5.57; 54 1.25,5.57; 55 0.75,5.57; 56 0.25,5.57; 57 -0.25,5.57; 58 -0.75,5.57; 59 -1.25,5.57; 60 -1.75,5.57; 61 -2.25,5.57; 62 -2.75,5.57; 63 -3.25,5.57; 64 -3.75,5.57
SOT-23-3L-L = smd 0.61 x 0.61: 1 -0.95,-1.194; 2 0.95,-1.194; 3 0,1.194
ENDTIVA = drill 1 pad 1.93: 3.3V 8.89,2.54; DIO 11.43,2.54; GND 6.35,2.54; P$1 3.81,27.94; P$2 6.35,27.94; P$3 8.89,27.94; P$4 11.43,27.94; P$5 13.97,27.94
ZX62-AB-5PA(11) = smd 1.35 x 0.4: D+ 2.675,0; D- 2.675,-0.65; GND 2.675,1.3; ID 2.675,0.65; VCC 2.675,-1.3 | smd 1.9 x 1.8: S1 0,-4; S2 0,4 | smd 1.6 x 2.1: S3 2.55,3.1; S4 2.55,-3.1
XTAL_AB26TRB-32.768KHZ-T = smd 2.5 x 1: 1 3.875,1.25; 2 3.875,-1.25 | smd 2.5 x 2.5: 3 -3.875,0
XTAL500X320X130N = smd 1.95 x 2.95: 1 -2.15,0; 2 2.15,0

### Placement (x,y rotation side)
3.3V  75.5,66 270 top
B1  20,58 0 top
C1  32,47.5 90 top
C2  30,49.5 90 top
C3  30,40 270 top
C4  30,44 90 top
C5  34,44.5 180 top
C6  48,55.5 270 top
C7  41.5,51.5 90 top
C8  52.5,44 0 top
C9  33,41 180 top
C10  52.5,39.5 0 top
C11  43,33 270 top
C12  43.5,51.5 90 top
C13  41,33 270 top
C14  58.5,62.5 270 top
C15  52,69 0 top
C16  69.5,63.5 180 top
C17  70,67 90 top
CR1  71,50 0 top
CR3  71,40.5 0 top
H1  96,67 0 bottom
H2  4,67 0 bottom
H3  4,4 270 top
H4  96,4 0 bottom
IC2  50,63.5 0 top
J1  13.5,66.5 0 top
J2  27.25,59.75 0 top
J3  15,49.5 270 top
J4  12.5,49.5 0 top
J5  27.25,56.5 0 top
J7  20.75,66.5 0 top
LED1  43.75,66.5 0 top
MOTOR1  98.5,55.5 90 top
MOTOR2  98.5,42 90 top
MOTOR3  98.5,28.5 90 top
MOTOR4  98.5,15 90 top
PROG  1.5,42 270 top
R1  26.5,47 180 top
R2  41.75,66.5 90 top
R3  100  [R0805']  12,25.5 90 top
R4  1.2k  [R0805']  17.5,22.5 270 top
R5  59.5,52.5 270 bottom
R6  68,52.5 180 bottom
R7  59.5,48.5 270 bottom
R8  68,48.5 180 bottom
R9  83.5,48 90 bottom
R10  73.5,48.5 0 bottom
R11  83.5,52 90 bottom
R12  73.5,51.5 0 bottom
R21  59.5,43 270 bottom
R22  68,42.5 180 bottom
R23  59.5,37.5 270 bottom
R24  68,39 180 bottom
R25  83.5,37.5 90 bottom
R26  73.5,38.5 0 bottom
R27  83.5,43 90 bottom
R28  73.5,43 0 bottom
R29  1.2k  [R0805']  15.5,22.5 270 top
RS485  1.5,26.5 270 top
S1  85,65.5 180 top
SN75  17.5,28.5 270 top
U1  43,42.5 180 top
U3  62.5,52.5 90 bottom
U4  62.5,48.5 90 bottom
U5  80.5,48 270 bottom
U6  80.5,52 270 bottom
U11  62.5,43 90 bottom
U12  62.5,37.5 90 bottom
U13  80.5,37.5 270 bottom
U14  80.5,43 270 bottom
U$1  53,31 270 top
U$2  32.5,69.75 180 top
USB  61.5,69 270 top
XTAL1  35.5,53 270 top
Y1  26,42.5 90 top

### Tracks (layer width: path | path; a pad name or v marks a point on that pad's centre or on a via)
3.3V  (via drill 0.35)
  Top 0.152: C13.1 41.75,34.6 41.75,35.39 41.57,35.58 41.57,36.08 41.75,36.26 U1.54 | C10.1 51.4,39.25 50.11,39.25 49.92,39.07 49.42,39.07 49.24,39.25 U1.2 | U1.37 35.1,44.25 C5.1 | U1.42 34.6,41.75 C9.1 | U1.11 49.39,43.75 49.42,43.72 51.37,43.72 C8.1 | U1.26 42.25,48.89 42.28,48.92 42.28,49.87 C7.1
  Bottom 0.152: R11.2 81.79,52.85 U6.1 | R9.2 81.79,48.85 U5.1 | U11.1 59.6,42.05 R21.2 | R23.2 61.21,36.65 U12.1 | U14.1 83.4,43.95 R27.2 | R25.2 81.79,38.35 U13.1 | U3.1 59.6,51.55 R5.2 | R7.2 61.21,47.65 U4.1
  other vias: 83.5,43.85 83.5,38.35 83.5,48.85 83.5,52.85 59.5,51.65 59.5,47.65 59.5,42.15 59.5,36.65
  pour Top: -0.5,0 -0.5,71 0,71.5 101,71.5 101.09,71.41 101.09,0.09 100.5,-0.5 0,-0.5
3.3VIN  (via drill 0.35)
  Top 0.152: 70.5,65.97 70.17,65.97 v70.08,66.08
  Top 0.254: 3.3V.2 70.5,65.97 | J5.2 32.5,59.21 32.5,61.25 | 32.5,61.25 U$2.3 | IC2.17 52.92,64.86 52.84,64.77 52.84,64.09 v52.25,63.5 | v34.5,61.25 32.5,61.25 | IC2.4 47.73,63.28 v47.5,63.5 | C17.1 v70.08,66.08
  Bottom 0.254: v34.5,61.25 36.75,63.5 v47.5,63.5 v52.25,63.5 53.86,63.5 54.23,63.13 67.13,63.13 v70.08,66.08
5V  (via drill 0.35)
  Top 0.152: 85,63.5 S1.5 | 83.46,61.54 83.19,61.27 74.77,61.27 | 72.52,63.52 3.3V.3 | 70.42,63.58 C16.1 | 50.98,62.03 50.98,67 IC2.20 50.98,68.83 | v75,44.08 73.92,43 CR3.16
  Top 0.254: v7.5,32 7.5,37.7 6.72,38.48 6.72,57.18 J1.2 v18.64,69.11 | SN75.1 19.41,29.1 19.96,28.54 19.96,24.01 R4.2 | v71.5,51.5 71.5,48.72 v71.28,48.5 71.28,42.78 v71,42.5 71,40.92 70.99,40.91 70.99,39.36 71,39.35 v71,38.67 | CR1.16 v73.92,52.58 73.92,60.42 74.77,61.27 | 74.77,61.27 72.52,63.52 | 74.77,61.27 81.73,61.27 81.78,61.22 83.22,61.22 83.38,61.38 83.38,61.46 83.46,61.54 84.67,62.75 S1.5 | 3.3V.3 70.54,63.69 70.42,63.58 | C16.1 69.58,62.73 69.58,62.63 69.5,62.56 v69.5,62 | S1.2 85,63.5 | 50.98,67 50.98,68.83 C15.1 49.93,69 49.68,69.25 v45.5,69.25 | IC2.20 50.98,62.03 v51,62 | U$2.2 v34,69.11 | v28.33,69.11 28.08,68.85 28.08,66.33 27.25,65.5 J2.1
  Bottom 0.152: v75,44.08 74.7,43.78 73.75,43.78 72.98,43 R28.2
  Bottom 0.254: v7.5,32 15.07,32 15.23,32.16 18.11,32.16 SN75.1 | R6.2 69.85,51.5 v71.5,51.5 R12.2 73.73,52.58 v73.92,52.58 | R8.2 v71.28,48.5 R10.2 | R22.2 v71,42.5 72.15,42.5 R28.2 | R24.2 69.72,39 69.8,38.92 71,38.92 | R26.2 72.23,38.92 71,38.92 | 71,38.92 v71,38.67 | v51,62 58.18,62 58.23,62.05 58.77,62.05 58.82,62 v69.5,62 | v18.64,69.11 v28.33,69.11 v34,69.11 45.35,69.11 v45.5,69.25
  other vias: 19.41,30.86
!DIR1  (via drill 0.35)
  Top 0.152: MOTOR1.4 90,57 89.61,57.39 89.61,58.75 89,59.36 v89,59.41 | v67.59,58.5 67.59,58.02 66.81,57.24 66.81,50.5 66.5,50.2 66.5,47.13 66.81,46.82 66.81,42.16 67.25,41.72 67.83,41.72 CR3.3
  Bottom 0.152: v89,59.41 68.5,59.41 v67.59,58.5
!DIR2  (via drill 0.35)
  Top 0.152: CR3.5 67.83,40.42 67.25,40.42 66.5,41.16 66.5,46.69 66.2,47 66.2,50.33 66.5,50.63 66.5,58.27 67.5,59.27 v67.5,59.5 | v88.4,60.1 88.4,59.67 88.39,59.66 88.39,44.11 89,43.5 MOTOR2.4
  Bottom 0.152: v67.5,59.5 68.16,59.5 68.37,59.71 88.02,59.71 v88.4,60.1
!DIR3  (via drill 0.35)
  Top 0.152: v75.61,30 75.5,30.11 75.5,38.53 74.75,39.28 74.17,39.28 CR3.11
  Bottom 0.152: MOTOR3.4 v75.61,30
  other vias: 91.8,30
!DIR4  (via drill 0.35)
  Top 0.152: CR3.13 74.17,40.58 74.75,40.58 76.5,38.83 v76.5,18
  Bottom 0.152: MOTOR4.4 82.1,16.5 81.43,15.84 78.66,15.84 v76.5,18
  other vias: 91.8,16.5
!M1  (via drill 0.35)
  Top 0.152: CR1.3 68.32,51.22 68.91,51.22 69.5,51.81 v69.5,57.5 | v94.73,57 94.73,54.23 v94.5,54
  Bottom 0.152: v69.5,57.5 94,57.5 94.5,57 v94.73,57 | MOTOR1.2 v94.5,54
  other vias: 91.8,54
!M2  (via drill 0.35)
  Top 0.152: v95,40.5 95,46.58 94.97,46.61 94.97,50.89 95.11,51.03 95.11,55.11 v95.5,55.5 | CR1.5 68.16,49.76 68.75,49.76 70,51.01 70,55.72 v70.5,56.22
  Bottom 0.152: v95.5,55.5 94.78,56.22 94.07,56.22 94.07,56.21 93.57,56.21 93.57,56.22 v70.5,56.22 | v95,40.5 MOTOR2.2
  other vias: 91.8,40.5
!M3  (via drill 0.35)
  Top 0.152: v72.35,28 72.35,28.35 72.5,28.5 72.5,39.21 71.95,39.76 71.95,40.51 72.5,41.06 72.5,48.5 73.03,49.03 CR1.11
  Bottom 0.152: MOTOR3.2 82.82,27 81.43,28.38 80.45,28.38 80.06,28 v72.35,28
  other vias: 91.8,27
!M4  (via drill 0.35)
  Top 0.152: CR1.13 73.68,50.08 73.09,50.08 72.19,49.19 72.19,41.18 71.65,40.64 71.65,39.63 72.19,39.08 72.19,28.63 72.18,28.61 72.1,28.61 71.74,28.25 71.74,17.26 v74.5,14.5
  Bottom 0.152: v74.5,14.5 75.5,13.5 MOTOR4.2
  other vias: 91.8,13.5
!RS_RX
  Top 0.152: SN75.7 18.14,27.37 17.5,28 RS485.2
!RS_TX
  Top 0.152: RS485.4 8.65,24.55 R3.1 15.7,24.55 16.1,24.95 16.1,25.38 SN75.6 16.86,24.81 R29.1
!RST
  Top 0.152: PROG.5 9.07,39.87 9.49,39.87 11.39,41.77 11.39,43.25 12.5,44.36 J4.1 12.5,52.22 B1.4 B1.3 23.98,50.38 R1.1 28.62,45.73 30.84,45.73 30.98,45.59 30.98,44.95 32.41,43.52 35.59,43.52 35.82,43.75 35.89,43.75 36.08,43.93 36.58,43.93 36.76,43.75 U1.38
D+  (via drill 0.35)
  Top 0.152: USB.D+ 61.28,66.1 61.28,65.35 61,65.07 v61,64.5 | IC2.15 54.23,64.06 v54.5,63.79
  Bottom 0.152: v61,64.5 60.29,63.79 v54.5,63.79
D-  (via drill 0.35)
  Top 0.152: USB.D- 60.85,65.35 v60,64.5 | v53.5,64.5 53.58,64.58 IC2.16
  Bottom 0.152: v60,64.5 59.36,64.5 59.25,64.39 53.61,64.39 v53.5,64.5
DIR1  (via drill 0.35)
  Top 0.152: CR3.2 67.83,42.37 67.25,42.37 67.11,42.5 67.11,46.95 66.89,47.17 66.89,47.89 66.81,47.98 66.81,50.07 67.11,50.38 67.11,57.11 v68.5,58.5 | v89,58.5 89,56 89.5,55.5 MOTOR1.3
  Bottom 0.152: v68.5,58.5 v89,58.5
DIR1_SIG  (via drill 0.35)
  Top 0.152: CR3.1 68.02,42.78 v67.82,42.97
  Bottom 0.152: v67.82,42.97 67.62,42.97 R22.1 64.19,42.5 U11.3
DIR2  (via drill 0.35)
  Top 0.152: MOTOR2.3 89.5,42 88,43.5 88,59.64 87.8,59.85 87.8,60.02 v87.49,60.32 | v66.59,59.22 66.59,58.79 66.2,58.4 66.2,50.76 65.89,50.45 65.89,46.87 66.2,46.57 66.2,40.82 67.25,39.77 67.83,39.77 CR3.6
  Bottom 0.152: v66.59,59.22 66.89,59.52 66.89,59.75 67.46,60.32 v87.49,60.32
DIR2_SIG  (via drill 0.35)
  Top 0.152: CR3.7 68.06,38.89 v67.05,38.89
  Bottom 0.152: R24.1 v67.05,38.89 65.65,37.5 U12.3
DIR3  (via drill 0.35)
  Top 0.152: CR3.10 74.17,38.63 74.75,38.63 75,38.38 75,29.5 v75.5,29
  Bottom 0.152: MOTOR3.3 91.3,29 v75.5,29
  other vias: 91.8,28.5
DIR3_SIG  (via drill 0.35)
  Top 0.152: CR3.9 v73.82,38.12
  Bottom 0.152: U13.3 78.31,38.5 74.5,38.5 | 74.5,38.5 R26.1 | v73.82,38.12 74.12,38.12 74.5,38.5
DIR4  (via drill 0.35)
  Top 0.152: v76.82,16.82 77.11,17.11 77.11,18.25 77,18.36 77,38.98 74.75,41.23 74.17,41.23 CR3.14
  Bottom 0.152: MOTOR4.3 78.64,15 v76.82,16.82
  other vias: 91.8,15
DIR4_SIG  (via drill 0.35)
  Top 0.152: v74.94,42.12 CR3.15 | CR3.15
  Bottom 0.152: U14.3 R28.1 74.35,42.71 v74.94,42.12
ENDEFF  (via drill 0.35)
  Top 0.152: U1.43 37.26,41.08 36.66,41.08 36.58,41 35,41 34.73,40.73 34.73,26.27 v35,26 | v53.5,25 54.35,24.15 54.35,21.62 55.54,20.42 U$1.DIO
  Bottom 0.152: v35,26 36,25 v53.5,25
GND  (via drill 0.35)
  Top 0.152: B1.1 B1.2 v24,60.25 24.25,60.25 24.5,60 | 3.3V.1 70.41,68.26 C17.2 | SN75.4 15.5,30.96 v15.5,31.5 | IC2.18 52.27,68.42 C15.2 | IC2.25 47.73,68.22 v48,68.5 | IC2.26 47.08,68.42 v47,68.5 | IC2.21 50.08,67.4 50.08,67.95 49.94,68.08 49.92,68.08 v49.5,68.5 | C14.2 v58.5,61.39 | USB.GND 62.8,64.97 v63,64.77 | U1.55 42.25,35.9 v42.17,35.83 | U1.3 49.6,39.75 v49.67,39.67 | U1.12 49.6,44.25 v49.67,44.33 | U1.27 41.75,49.1 v41.67,49.17 | U1.32 39.25,48.75 v39,49 | CR1.8 67.83,47.97 67.25,47.97 67.11,48.1 67.11,49.95 67.25,50.08 67.83,50.08 CR1.4
  Top 0.254: IC2.7 49.67,58.83 v50,58.5 | CR3.8 68,38.15 v68,38.05 | CR3.4 69.09,40.83 v69.13,40.87 | CR3.12 72.91,40.17 v72.87,40.13 | CR1.12 74.02,49.58 v75.03,49.58 | CR1.8 67.77,47.42 v67.5,47.42 | U1.39 36.4,43.25 v36.33,43.33
  Bottom 0.152: RS485.5 8.5,23.5 | C9.2 32,41 | v58.5,61.39 58.5,61.5
  Bottom 0.254: v68,38.05 68,38
  other vias: 43,32.15 41,32.15 8.2,23.5 15.5,21.55 30,39.15 32.15,41 33.15,44.5 30,44.85 43.5,52.35 41.5,52.35 48,54.65 52.85,69 68.65,63.5 70,67.85 91.8,58.5 91.8,45 91.8,31.5 91.8,18 16.02,60.25 43.75,67.55 53.35,44 53.35,39.5 29.5,63.05
  pour Bottom: -0.5,0.5 -0.5,71 0,71.5 99.5,71.5 101,70 101,1 99.5,-0.5 0.5,-0.5
GNDX  (via drill 0.35)
  Top 0.152: U1.35 36.68,45.25 v35.72,46.22 | C2.1 31.02,47.63 31.02,47.61 31.16,47.47 31.18,47.47 C1.1
  Bottom 0.152: v35.72,46.22 32.28,46.22 32,46.5 C1.1
  other vias: 32,46.65
M1  (via drill 0.35)
  Top 0.152: CR1.2 68.32,51.87 68.91,51.87 69.04,52 69.04,56.67 v68.89,56.82 | v93.82,56.82 93.82,52.82 93.5,52.5 MOTOR1.1
  Bottom 0.152: v68.89,56.82 v93.82,56.82
M1_SIG  (via drill 0.35)
  Top 0.152: v67.82,52.5 67.85,52.5 CR1.1
  Bottom 0.152: v67.82,52.5 R6.1 U3.3
M2  (via drill 0.35)
  Top 0.152: v94.5,39 94.5,40.14 94.39,40.25 94.39,40.75 94.5,40.86 v94.5,53 | CR1.6 68.32,49.27 68.91,49.27 70.61,50.97 v70.61,54
  Bottom 0.152: MOTOR2.1 v94.5,39 | v94.5,53 90.5,53 89.5,54 v70.61,54
  other vias: 91.8,39
M2_SIG  (via drill 0.35)
  Top 0.152: v69.35,47.42 69.04,47.72 69.04,48 68.67,48.38 CR1.7
  Bottom 0.152: U4.3 67,48.5 R8.1 67.48,48.5 68.25,47.72 69.04,47.72 v69.35,47.42
M3  (via drill 0.35)
  Top 0.152: CR1.10 74.17,48.13 74.75,48.13 74.89,48 74.89,44.98 72.96,43.05 72.96,41.08 72.26,40.39 72.26,39.88 72.96,39.19 72.96,26.54 v73.5,26
  Bottom 0.152: v73.5,26 74,25.5 80.1,25.5 80.45,25.84 81.43,25.84 81.78,25.5 MOTOR3.1
  other vias: 91.8,25.5
M3_SIG  (via drill 0.35)
  Top 0.152: v73.82,47.62 CR1.9
  Bottom 0.152: U5.3 78.81,48.5 R10.1 73.82,47.97 v73.82,47.62
M4  (via drill 0.35)
  Top 0.152: v72.5,12 71.44,13.06 71.44,28.38 71.78,28.72 71.78,29.78 71.89,29.89 71.89,38.96 71.34,39.5 71.34,40.77 71.89,41.31 71.89,49.53 73.09,50.73 73.68,50.73 CR1.14
  Bottom 0.152: MOTOR4.1 v72.5,12
  other vias: 91.8,12
M4_SIG  (via drill 0.35)
  Top 0.152: CR1.15 v74.94,51.62 | v74.94,51.62
  Bottom 0.152: R12.1 74.81,51.5 v74.94,51.62 78.93,51.62 U6.3
M_DIR_0  (via drill 0.35)
  Top 0.152: U1.61 45.41,36.77 45.41,35.45 45.95,34.91 46.91,34.91 47.82,35.83 48.25,35.83 49,36.58 v49,37.34 | v56.99,37.34 57.5,37.86 v57.5,43.5
  Bottom 0.152: v49,37.34 v56.99,37.34 | v57.5,43.5 57.85,43.85 R21.1 59.6,43.95 U11.2
M_DIR_1  (via drill 0.35)
  Top 0.152: U1.62 45.75,36.11 45.72,36.08 45.72,35.58 46.08,35.22 46.58,35.22 47.36,36 47.57,36 v48,36.43
  Bottom 0.152: v48,36.43 57.58,36.43 R23.1 61.21,38.35 U12.2
M_DIR_2  (via drill 0.35)
  Top 0.152: U1.63 46.33,36.85 v46.33,35.83
  Bottom 0.152: R25.1 81.79,36.65 U13.2 80.97,35.83 v46.33,35.83
M_DIR_3  (via drill 0.35)
  Top 0.152: U1.64 v47.09,36.59
  Bottom 0.152: R27.1 81.79,42.15 U14.2 78.92,39.28 69.94,39.28 69.44,39.78 59.55,39.78 58.72,38.94 58.72,38.22 57.24,36.74 48.55,36.74 48.25,37.04 47.75,37.04 47.3,36.59 v47.09,36.59
N$1
  Top 0.254: LED1.A 41.8,65.45 R2.1
OSC0
  Top 0.152: Y1.2 27.5,43.15 C4.1 30.43,42.72 36.58,42.72 36.61,42.75 U1.40
OSC1
  Top 0.152: U1.41 31.4,42.25 C3.1 26.5,40.85 Y1.1
RS_RX
  Top 0.152: SN75.8 19.41,28.59 18.5,29.5 RS485.1
RS_TX
  Top 0.152: RS485.3 11.95,26.5 R3.2 15.28,26.45 SN75.5 16.36,26.9 16.36,27.33 16.49,27.46 17.24,27.46 17.5,27.2 R4.1
T0PWM0  (via drill 0.35)
  Top 0.152: v58,53 56.89,51.89 v56.89,41.5 | v49.67,40.67 48.65,40.67 U1.5
  Bottom 0.152: U3.2 59.6,53.45 R5.1 58.35,53.35 v58,53 | v56.89,41.5 56.07,40.67 v49.67,40.67
T0PWM1  (via drill 0.35)
  Top 0.152: v50,49 50,46 49.75,45.75 U1.15
  Bottom 0.152: U4.2 59.6,49.45 R7.1 57.78,49.35 57.77,49.34 50.34,49.34 v50,49
T1PWM0  (via drill 0.35)
  Top 0.152: U1.30 40.25,49.54 v40.36,49.64
  Bottom 0.152: R9.1 81.79,47.15 U5.2 78.56,50.19 41.83,50.19 41.28,49.64 v40.36,49.64
T1PWM1  (via drill 0.35)
  Top 0.152: U1.31 39.75,50.75 v40,51
  Bottom 0.152: v40,51 58.78,51 59.05,50.72 81.36,50.72 U6.2 81.79,51.15 R11.1
TCK  (via drill 0.35)
  Top 0.152: U1.52 40.75,35.53 v39.72,34.5 | J3.7 13.5,35.76 v13.5,44.5
  Bottom 0.152: v39.72,34.5 39.48,34.26 J3.7 | v13.5,44.5 13,45 PROG.1
  other vias: 8.2,45
TDI  (via drill 0.35)
  Top 0.152: U1.50 39.58,36.76 39.58,36.16 38.89,35.47 v38,35.47 | v16.14,35.86 16.14,36.29 16.17,36.32 16.17,40.71 J3.4
  Bottom 0.152: v38,35.47 16.53,35.47 v16.14,35.86 | J3.4 12.74,41.88 12.25,41.39 9.09,41.39 PROG.4
  other vias: 8.2,40.5
TDO  (via drill 0.35)
  Top 0.152: U1.49 38.43,36.93 v38,36.5 | v12.29,39.5 12.29,41.71 v12,42
  Bottom 0.152: v38,36.5 17.84,36.5 J3.5 14.84,39.5 v12.29,39.5 | v12,42 PROG.3
  other vias: 8.2,42
TMS  (via drill 0.35)
  Top 0.152: U1.51 40.25,36.31 v38.81,34.87 | v12.89,37 12.89,43.11 v12.5,43.5
  Bottom 0.152: v38.81,34.87 16.05,34.87 15,35.91 J3.6 14.8,37 v12.89,37 | v12.5,43.5 PROG.2
  other vias: 8.2,43.5
U0RX
  Top 0.152: IC2.1 45.77,59.22 46.39,58.61 46.75,58.61 47.11,58.25 47.11,57.75 46.75,57.39 U1.17
U0TX  (via drill 0.35)
  Top 0.152: U1.18 46.25,57.75 v46.5,58 | v48.5,58 48.5,59.72 IC2.5
  Bottom 0.152: v46.5,58 v48.5,58
U1RX  (via drill 0.35)
  Top 0.152: SN75.2 18.14,36.14 v19.5,37.5 | U1.45 37.26,40.08 36.44,40.08 35.34,38.97 v35.34,37.5
  Bottom 0.152: v19.5,37.5 v35.34,37.5
U1TX  (via drill 0.35)
  Top 0.152: v36.22,39 36.52,39.3 36.52,39.44 36.83,39.75 U1.46 | v18,38.5 16.86,37.36 SN75.3
  Bottom 0.152: v36.22,39 35.72,38.5 v18,38.5
V_USB  (via drill 0.35)
  Top 0.152: S1.6 S1.3 82.38,68.38 | 68.62,67.87 68.62,68 | USB.VCC 60.2,66.08 59.55,65.42 59.42,65.42 v59,65 59,63.85 C14.1
  Top 0.254: v66.12,65.38 68.62,67.87 | 68.62,68 68.62,69.11 69.01,69.5 81.25,69.5 82.38,68.38 | U$2.1 v35.5,65
  Bottom 0.254: J2.2 35.04,65 v35.5,65 53.07,65 53.23,65.16 53.77,65.16 53.93,65 v59,65 59.12,65 59.55,65.43 63.27,65.43 63.32,65.38 v66.12,65.38
VDDC
  Top 0.152: C11.1 42.75,34.1 42.75,35.55 42.78,35.58 42.78,36.08 42.75,36.11 U1.56 U1.25 42.75,49.9 C12.1
XOSC0
  Top 0.152: C2.2 33.02,50.35 XTAL1.2 34.88,48.5 36.02,49.65 36.02,50.47 36.16,50.6 37.34,50.6 37.48,50.47 37.48,48.52 38.34,47.67 38.34,46.06 38.2,45.92 37.6,45.92 U1.34
XOSC1
  Top 0.152: C1.2 32.82,47.53 33.72,47.53 34.38,46.88 | U1.36 36.5,44.75 35.64,45.61 35.46,45.61 35.11,45.96 35.11,46.14 34.38,46.88 | XTAL1.1 36.62,49.12 34.38,46.88

### Text on the board
tPlace: GND | 5V | GND | 3.3V | LED1 | Power / Jumper | RESET | ESTOP | RESET | N/C | N/C | N/C | TDI | TDO | TMS | TCK | Peripheral Board | CableBot Control Board / V2.0